# Altium schematic sheet 2018.SchDoc
size A3; SheetNumber: 1; SheetTotal: 1
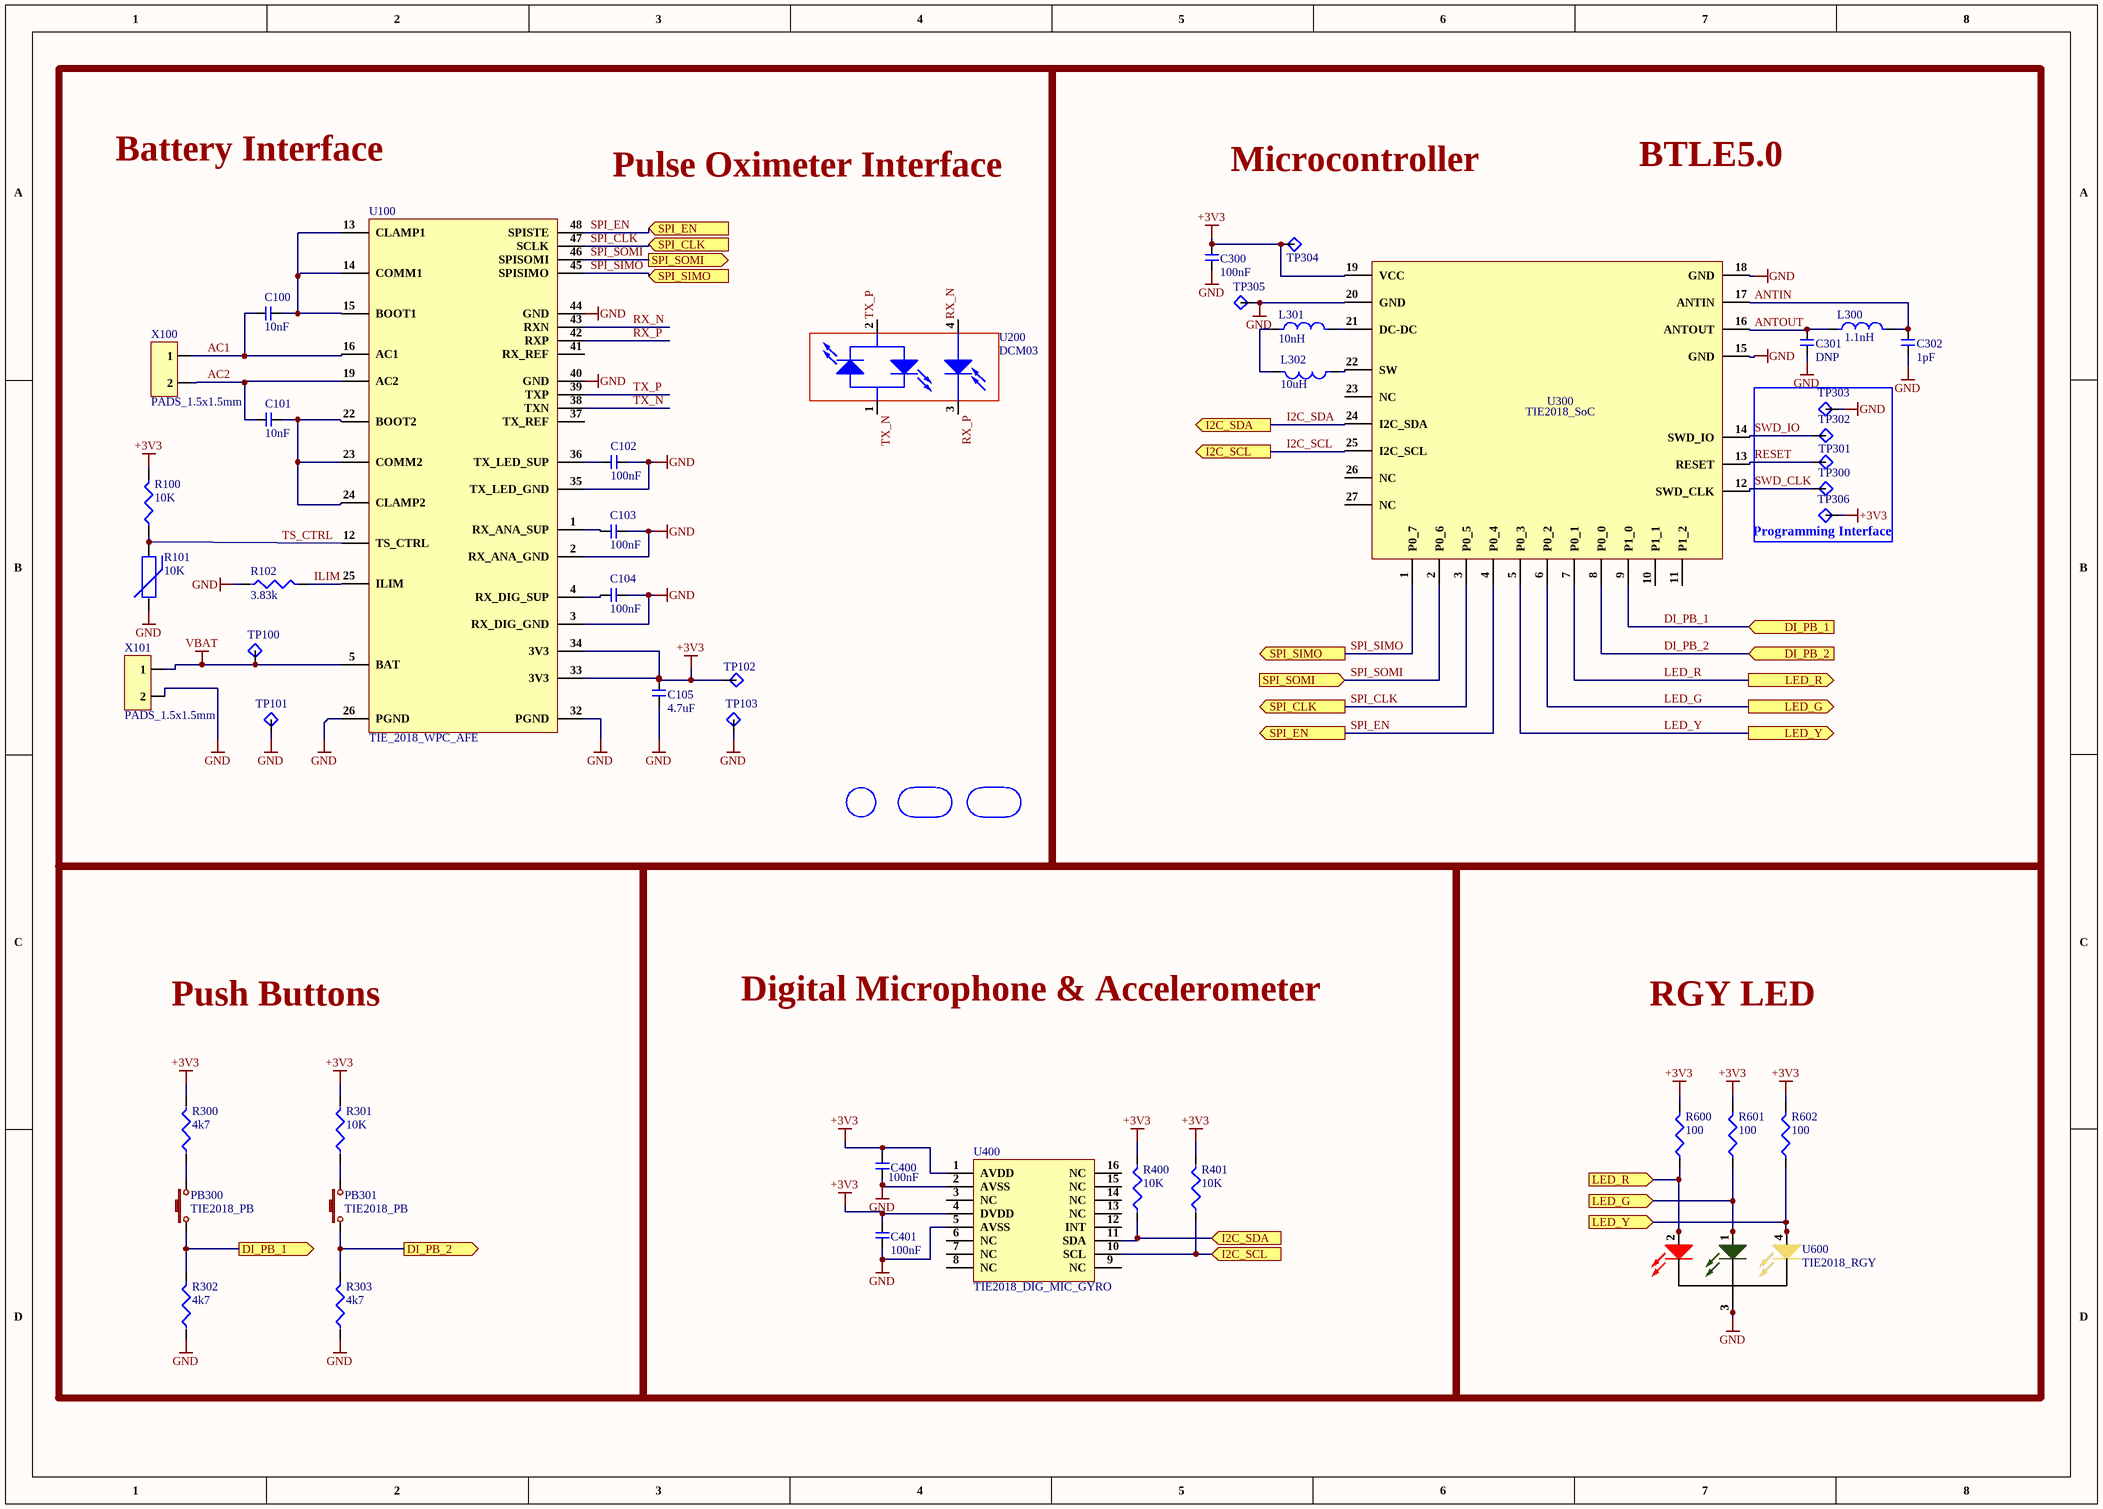
[diagram p0: 2018.SchDoc]

## Parts
C100  10nF  [C0603]
C101  10nF  [C0603]
C102  100nF  [C0402]
C103  100nF  [C0402]
C104  100nF  [C0402]
C105  4.7uF  [C0603]
C300  100nF  [C0402]
C301  DNP  [C0402]
C302  1pF  [C0402]
C400  100nF  [C0402]
C401  100nF  [C0402]
L300  1.1nH  [L0402]
L301  10nH  [L0402]
L302  10uH  [L0603]
MTH100  MTH_2mmx2mm  [MTH_2mmx2mm]  (value not drawn)
MTH101  MTH_2mmx3.5mm  [MTH_2mmx3.5mm]  (value not drawn)
MTH102  MTH_2mmx3.5mm  [MTH_2mmx3.5mm]  (value not drawn)
PB300  TIE2018_PB  [PB]
PB301  TIE2018_PB  [PB]
R100  10K  [R0402]
R101  10K  [R0402]
R102  3.83k  [R0402]
R300  4k7  [R0402]
R301  10K  [R0402]
R302  4k7  [R0402]
R303  4k7  [R0402]
R400  10K  [R0402]
R401  10K  [R0402]
R600  100  [R0402]
R601  100  [R0402]
R602  100  [R0402]
TP100  Test_Point_3  [TestPoint]  (value not drawn)
TP101  Test_Point_3  [TestPoint]  (value not drawn)
TP102  Test_Point_3  [TestPoint]  (value not drawn)
TP103  Test_Point_3  [TestPoint]  (value not drawn)
TP300  Test_Point_3  [TestPoint]  (value not drawn)
TP301  Test_Point_3  [TestPoint]  (value not drawn)
TP302  Test_Point_3  [TestPoint]  (value not drawn)
TP303  Test_Point_3  [TestPoint]  (value not drawn)
TP304  Test_Point_3  [TestPoint]  (value not drawn)
TP305  Test_Point_3  [TestPoint]  (value not drawn)
TP306  Test_Point_3  [TestPoint]  (value not drawn)
U100  TIE_2018_WPC_AFE  [WPC_AFE]
U200  DCM03  [DMC03]
U300  TIE2018_SoC  [SoC]
U400  TIE2018_DIG_MIC_GYRO  [DIGI_MIC_GYRO]
U600  TIE2018_RGY  [SMP4-RGY]
X100  PADS_1.5x1.5mm  [PADS_1.5x1.5mm]
X101  PADS_1.5x1.5mm  [PADS_1.5x1.5mm]

## Blocks framed on the sheet
Programming Interface: TP300-TP303 TP306
Push Buttons: PB300 PB301 R300-R303
Digital Microphone & Accelerometer: C400 C401 R400 R401 U400
RGY LED: R600-R602 U600

## Ports
DI_PB_1 (in), DI_PB_1 (out), DI_PB_2 (in), DI_PB_2 (out), I2C_SCL (in), I2C_SCL (out), I2C_SDA (in), I2C_SDA (out), LED_G (in), LED_G (out), LED_R (in), LED_R (out), LED_Y (in), LED_Y (out), SPI_CLK (in), SPI_CLK (out), SPI_EN (in), SPI_EN (out), SPI_SIMO (in), SPI_SIMO (out), SPI_SOMI (in), SPI_SOMI (out)

## Nets
+3V3: C105.2 C300.2 C400.2 C401.2 R100.2 R300.2 R301.2 R400.2 R401.2 R600.2 R601.2 R602.2 TP102.1 TP304.1 TP306.1 U100.33(3V3) U100.34(3V3) U300.19(VCC) U400.1(AVDD) U400.4(DVDD)
GND: C102.2 C103.2 C104.2 C105.1 C300.1 C301.1 C302.1 C400.1 C401.1 R101.1 R102.1 R302.1 R303.1 TP101.1 TP103.1 TP303.1 TP305.1 U100.2(RX_ANA_GND) U100.3(RX_DIG_GND) U100.26(PGND) U100.32(PGND) U100.35(TX_LED_GND) U100.40(GND) U100.44(GND) U300.15(GND) U300.18(GND) U300.20(GND) U400.2(AVSS) U400.5(AVSS) U600.3 X101.2
VBAT: TP100.1 U100.5(BAT) X101.1
AC1: C100.1 U100.16(AC1) X100.1
AC2: C101.1 U100.19(AC2) X100.2
ANTIN: C302.2 L300.2 U300.17(ANTIN)
ANTOUT: C301.2 L300.1 U300.16(ANTOUT)
DI_PB_1: PB300.1 R302.2 U300.9(P1_0) ; port DI_PB_1
DI_PB_2: PB301.1 R303.2 U300.8(P0_0) ; port DI_PB_2
I2C_SCL: R401.1 U300.25(I2C_SCL) U400.10(SCL) ; port I2C_SCL
I2C_SDA: R400.1 U300.24(I2C_SDA) U400.11(SDA) ; port I2C_SDA
ILIM: R102.2 U100.25(ILIM)
LED_G: R601.1 U300.6(P0_2) U600.1 ; port LED_G
LED_R: R600.1 U300.7(P0_1) U600.2 ; port LED_R
LED_Y: R602.1 U300.5(P0_3) U600.4 ; port LED_Y
RESET: TP301.1 U300.13(RESET)
RX_N: U100.43(RXN) U200.4
RX_P: U100.42(RXP) U200.3
SPI_CLK: U100.47(SCLK) U300.3(P0_5) ; port SPI_CLK
SPI_EN: U100.48(SPISTE) U300.4(P0_4) ; port SPI_EN
SPI_SIMO: U100.45(SPISIMO) U300.1(P0_7) ; port SPI_SIMO
SPI_SOMI: U100.46(SPISOMI) U300.2(P0_6) ; port SPI_SOMI
SWD_CLK: TP300.1 U300.12(SWD_CLK)
SWD_IO: TP302.1 U300.14(SWD_IO)
TS_CTRL: R100.1 R101.2 U100.12(TS_CTRL)
TX_N: U100.38(TXN) U200.1
TX_P: U100.39(TXP) U200.2
NetC100_2: C100.2 U100.13(CLAMP1) U100.14(COMM1) U100.15(BOOT1)
NetC101_2: C101.2 U100.22(BOOT2) U100.23(COMM2) U100.24(CLAMP2)
NetC102_1: C102.1 U100.36(TX_LED_SUP)
NetC103_1: C103.1 U100.1(RX_ANA_SUP)
NetC104_1: C104.1 U100.4(RX_DIG_SUP)
NetL301_1: L301.1 L302.1
NetL301_2: L301.2 U300.21(DC-DC)
NetL302_2: L302.2 U300.22(SW)
NetPB300_2: PB300.2 R300.1
NetPB301_2: PB301.2 R301.1

Not connected (* = marked no-connect by the designer): U100 37(TX_REF) 41(RX_REF); U300 10(P1_1) 11(P1_2) 23(NC) 26(NC) 27(NC); U400 3(NC) 6(NC) 7(NC) 8(NC) 9(NC) 12(INT) 13(NC) 14(NC) 15(NC) 16(NC)

## Notes on the sheet
- Battery Interface
- Pulse Oximeter Interface
- Microcontroller
- BTLE5.0

## Library data of the parts
C100 C101 = C0603X103F3GACTU: Cap, 0.01ΜF, 25V, 1%, C0G/NP0, 0603; Manufacturer: KEMET; Supplier 1: Newark; Supplier Part Number 1: 69AC2632; Manufacturer Part Number: C0603X103F3GACTU; RoHS: Yes; Category: Capacitors; Stock 1: 210; Pricing 1: 1=2.42000, 10=1.96000, 25=1.81000, 50=1.65000, 100=1.50000 (USD); RoHS Compliant: Yes
C102-C104 C300 C400 C401 = 939113424610-T3N: Silicon Capacitor 100nF 11VDC 0402; Manufacturer: Murata; Supplier 1: Avnet; Supplier Part Number 1: 939113424610-T3N; Manufacturer Part Number: 939113424610-T3N; RoHS: No; Category: Capacitors; Pricing 1: 1000=6.60300, 2000=6.41700, 4000=6.23100, 6000=6.04500, 8000=5.85900 (USD)
C105 = C1608X5R1V475M080AC: C Series 0603 4.7 uF 35 V ±20 % Tolerance X5R SMT Multilayer Ceramic Capacitor; Manufacturer: TDK; Voltage Rating: 35V; Tolerance: 20%; Supplier 1: Arrow Electronics; Supplier Part Number 1: C1608X5R1V475M080AC; Manufacturer Part Number: C1608X5R1V475M080AC; RoHS: Yes; Category: Ceramic Capacitors; Stock 1: 2450; Pricing 1: 1=0.42890, 10=0.23670, 25=0.23340, 50=0.22950, 100=0.18270, 250=0.18070, 500=0.13610, 1000=0.11450, 3000=0.11340 (USD); Mount: Surface Mount; Case/Package: 0603; Case Code (Metric): 1608; Case Code (Imperial): 0603; Weight: 7.1E-05oz; Dielectric Material: Ceramic; Min Operating Temperature: -55°C; Max Operating Temperature: 85°C; Capacitance: 4.7uF; Packaging: Tape and Reel; Termination: SMD/SMT; Package Quantity: 1; Voltage Rating (DC): 35V; Dielectric: X5R; Resistor Type: Ceramic; Series: C; Length: 1.6mm; Width: 0.031inch; Height: 0.8mm; Thickness: 0.039inch; Depth: 0.8mm; REACH SVHC: No SVHC; Lead Free: Lead Free; RoHS Compliant: Yes; ComponentLink1URL: https://datasheet.ciiva.com/24218/mlcc-commercial-general-en-24218312.pdf?src-supplier=Mouser; ComponentLink1Description: https://datasheet.ciiva.com/24218/mlcc-commercial-general-en-24218312.pdf?src-supplier=Mouser
C301 = 0402ZC101MAT2A: Cap Ceramic 100pF 10V X7R 20% SMD 0402 125°C Paper T/R; Manufacturer: Kyocera AVX; Supplier 1: Avnet; Supplier Part Number 1: 0402ZC101MAT2A; Manufacturer Part Number: 0402ZC101MAT2A; RoHS: Yes; Category: Ceramic Capacitors; Stock 1: 320000; Pricing 1: 10000=0.04060, 20000=0.04200, 40000=0.03864, 60000=0.03766, 80000=0.03668, 100000=0.03570, 1000000=0.03472 (USD); Mount: Surface Mount; Case/Package: 0402; Number of Pins: 2; Case Code (Imperial): 0402; Case Code (Metric): 1005; Min Operating Temperature: -55°C; Max Operating Temperature: 125°C; Capacitance: 100pF; Package Quantity: 10000; Voltage Rating: 10V; Voltage Rating (DC): 10V; Tolerance: 20%; Packaging: Tape and Reel; Dielectric: X7R; Termination: SMD/SMT; Construction: Flat; Length: 1mm; Width: 0.5mm; Thickness: 0.022inch; Depth: 0.5mm; RoHS Compliant: Yes; ComponentLink1URL: https://datasheet.ciiva.com/5419/cx7r-218113-5419800.pdf?src-supplier=Mouser; ComponentLink1Description: https://datasheet.ciiva.com/5419/cx7r-218113-5419800.pdf?src-supplier=Mouser; ComponentLink2URL: https://datasheet.ciiva.com/206/cx7r-206063.pdf?src-supplier=Digi-Key; ComponentLink2Description: https://datasheet.ciiva.com/206/cx7r-206063.pdf?src-supplier=Digi-Key
C302 = GCM1555C1H1R0CA16J: Cap Ceramic 1pF 50V C0G 0.25pF Pad SMD 0402 125C Automotive T/R; Manufacturer: Murata; Supplier 1: Arrow Electronics; Supplier Part Number 1: GCM1555C1H1R0CA16J; Manufacturer Part Number: GCM1555C1H1R0CA16J; RoHS: Yes; Category: Ceramic Capacitors; Stock 1: 268213; Pricing 1: 1=0.06050, 10=0.03030, 25=0.03000, 100=0.01940, 250=0.01910, 500=0.01350, 1000=0.01080, 3000=0.00950, 6000=0.00890, 15000=0.00840, 30000=0.00830, 75000=0.00820, 150000=0.00810 (USD); Mount: Surface Mount; Case/Package: 0402; Case Code (Imperial): 0402; Case Code (Metric): 1005; Weight: 0.000212oz; Min Operating Temperature: -55°C; Max Operating Temperature: 125°C; Capacitance: 1pF; Packaging: Tape and Reel; Voltage Rating: 50V; Dielectric: C0G; Termination: SMD/SMT; Voltage Rating (DC): 50V; Package Quantity: 50000; Length: 0.039inch; Width: 0.02inch; Height: 0.5mm; Thickness: 0.022inch; Ratings: AEC-Q200; ComponentLink1URL: http://www.mouser.com/ds/2/281/c03e-806517.pdf?src-supplier=Mouser; ComponentLink1Description: http://www.mouser.com/ds/2/281/c03e-806517.pdf?src-supplier=Mouser; ComponentLink2URL: https://search.murata.co.jp/Ceramy/image/img/A01X/G101/ENG/GCM1555C1H1R0CA16-01.pdf?src-supplier=Digi-Key; ComponentLink2Description: https://search.murata.co.jp/Ceramy/image/img/A01X/G101/ENG/GCM1555C1H1R0CA16-01.pdf?src-supplier=Digi-Key; ComponentLink3URL: http://www.murata.com/~/media/webrenewal/support/library/catalog/products/capacitor/mlcc/c03e.ashx?src-supplier=Digi-Key; ComponentLink3Description: http://www.murata.com/~/media/webrenewal/support/library/catalog/products/capacitor/mlcc/c03e.ashx?src-supplier=Digi-Key
L300 = LQG15WZ1N1C02D: Inductor RF Chip Unshielded Multi-Layer 0.0011uH 0.2nH 100MHz Air 1.2A 0.03Ohm DCR 0402 Automotive T/R; Manufacturer: Murata; DC Resistance (DCR): 30mR; Self Resonant Frequency: 14GHz; Supplier 1: Arrow Electronics; Supplier Part Number 1: LQG15WZ1N1C02D; Manufacturer Part Number: LQG15WZ1N1C02D; RoHS: Yes; Category: Fixed Inductors; Stock 1: 6887; Pricing 1: 1=0.04140, 10=0.04070, 25=0.04000, 100=0.03950, 250=0.03880, 500=0.03830, 1000=0.03760, 3000=0.03700, 6000=0.03640 (USD); Mount: Surface Mount; Case/Package: 0402; Core Material: Air; Case Code (Imperial): 0402; Case Code (Metric): 1005; Min Operating Temperature: -55°C; Max Operating Temperature: 125°C; Packaging: Tape and Reel; Inductance: 1.1nH; Current Rating: 1.2A; Shielding: Unshielded; Test Frequency: 100MHz; Ratings: AEC-Q200; RoHS Compliant: Yes; ComponentLink1URL: http://search.murata.co.jp/Ceramy/image/img/P02/JELF243B-9117.pdf?src-supplier=Digi-Key; ComponentLink1Description: http://search.murata.co.jp/Ceramy/image/img/P02/JELF243B-9117.pdf?src-supplier=Digi-Key; ComponentLink2URL: https://search.murata.co.jp/Ceramy/image/img/P02/JELF243B-9117.pdf?src-supplier=Digi-Key; ComponentLink2Description: https://search.murata.co.jp/Ceramy/image/img/P02/JELF243B-9117.pdf?src-supplier=Digi-Key
L301 = MHQ1005P10NJT000: Inductor High Frequency Chip Unshielded Multi-Layer 0.01uH 5% 100MHz 23Q-Factor Ceramic 0.5A 0.19Ohm DCR 0402 T/R; Manufacturer: TDK; Core Material: Non-Magnetic; Current Rating: 500mA; DC Resistance (DCR): 190mR; Self Resonant Frequency: 3.3GHz; Supplier 1: Arrow Electronics; Supplier Part Number 1: MHQ1005P10NJT000; Manufacturer Part Number: MHQ1005P10NJT000; RoHS: Yes; Category: Fixed Inductors; Stock 1: 9027; Pricing 1: 1=0.17480, 10=0.12050, 25=0.11830, 100=0.09750, 250=0.09360, 500=0.08470, 1000=0.07090, 3000=0.05930, 6000=0.05690 (USD); Mount: Surface Mount; Case/Package: 0402; Case Code (Metric): 1005; Case Code (Imperial): 0402; Min Operating Temperature: -55°C; Max Operating Temperature: 125°C; Package Quantity: 10000; Packaging: Tape and Reel; Tolerance: 5%; Shielding: Unshielded; Inductance Tolerance: 5%; Inductance: 10nH; Test Frequency: 100MHz; Max DC Current: 500mA; Length: 0.039inch; Width: 0.02inch; Height - Seated (Max): 0.024inch; RoHS Compliant: Yes; ComponentLink1URL: https://datasheet.ciiva.com/29683/inductor-commercial-high-frequency-mhq-en-29683658.pdf?src-supplier=Digi-Key; ComponentLink1Description: https://datasheet.ciiva.com/29683/inductor-commercial-high-frequency-mhq-en-29683658.pdf?src-supplier=Digi-Key; ComponentLink2URL: https://datasheet.ciiva.com/29683/inductor-commercial-high-frequency-mhq-en-29683659.pdf?src-supplier=Digi-Key; ComponentLink2Description: https://datasheet.ciiva.com/29683/inductor-commercial-high-frequency-mhq-en-29683659.pdf?src-supplier=Digi-Key; ComponentLink3URL: https://datasheet.ciiva.com/29683/inductor-commercial-high-frequency-mhq-en-29683660.pdf?src-supplier=Digi-Key; ComponentLink3Description: https://datasheet.ciiva.com/29683/inductor-commercial-high-frequency-mhq-en-29683660.pdf?src-supplier=Digi-Key
L302 = LQM18FN100M00D: 0603 10uH ±20% DCR=0.9Ω 50mA SRF=30MHz; Manufacturer: Murata; Core Material: Ferrite; Self Resonant Frequency: 30MHz; Shielding: Shielded; DC Resistance (DCR): 1.17R; Test Frequency: 1MHz; Supplier 1: Arrow Electronics; Supplier Part Number 1: LQM18FN100M00D; Manufacturer Part Number: LQM18FN100M00D; RoHS: Yes; Category: Fixed Inductors; Stock 1: 3450; Pricing 1: 1=0.15720, 10=0.10770, 25=0.09610, 100=0.08640, 250=0.08260, 500=0.08180, 1000=0.07310, 3000=0.07220 (USD); Mount: Surface Mount; Case/Package: 0603; Case Code (Metric): 1608; Case Code (Imperial): 0603; Min Operating Temperature: -55°C; Max Operating Temperature: 125°C; Packaging: Tape and Reel; Package Quantity: 4000; Tolerance: 20%; Current Rating: 50mA; Inductance: 10uH; Saturation Current: 50mA; Max DC Current: 50mA; Termination: SMD/SMT; DC Current: 50mA; Series: LQM18F; Length: 0.063inch; Width: 0.031inch; Height: 0.9mm; Height - Seated (Max): 0.035inch; Depth: 0.9mm; Radiation Hardening: No; Military Standard: Not; Lead Free: Lead Free; RoHS Compliant: Yes; ComponentLink1URL: https://datasheet.ciiva.com/11799/0900766b80f15512-11799471.pdf?src-supplier=RSComponents; ComponentLink1Description: https://datasheet.ciiva.com/11799/0900766b80f15512-11799471.pdf?src-supplier=RSComponents; ComponentLink2URL: https://datasheet.ciiva.com/3865/286lqm18fn100m0023-3865365.pdf?src-supplier=Arrow+Electronics; ComponentLink2Description: https://datasheet.ciiva.com/3865/286lqm18fn100m0023-3865365.pdf?src-supplier=Arrow+Electronics; ComponentLink3URL: https://datasheet.ciiva.com/1039/l0075s0097lqm18f-1039418.pdf?src-supplier=Digi-Key; ComponentLink3Description: https://datasheet.ciiva.com/1039/l0075s0097lqm18f-1039418.pdf?src-supplier=Digi-Key; ComponentLink4URL: https://datasheet.ciiva.com/1039/l0075s0097lqm18f-1039417.pdf?src-supplier=Digi-Key; ComponentLink4Description: https://datasheet.ciiva.com/1039/l0075s0097lqm18f-1039417.pdf?src-supplier=Digi-Key; ComponentLink5URL: https://datasheet.ciiva.com/1039/l0075s0097lqm18f-1039419.pdf?src-supplier=Digi-Key; ComponentLink5Description: https://datasheet.ciiva.com/1039/l0075s0097lqm18f-1039419.pdf?src-supplier=Digi-Key; ComponentLink6URL: https://datasheet.ciiva.com/8510/l0075s0097lqm18f-8510087.pdf?src-supplier=Avnet; ComponentLink6Description: https://datasheet.ciiva.com/8510/l0075s0097lqm18f-8510087.pdf?src-supplier=Avnet; ComponentLink7URL: https://datasheet.ciiva.com/8510/l0075s0097lqm18f-8510328.pdf?src-supplier=Avnet; ComponentLink7Description: https://datasheet.ciiva.com/8510/l0075s0097lqm18f-8510328.pdf?src-supplier=Avnet
PB300 PB301 = Push_Button
R100 R301 R400 R401 = CR0402-FX-1002GLF: Res Thick Film 0402 10K Ohm 1% 1/16W ±100ppm/°C Molded SMD SMD Paper Tape on Plastic Reel; Manufacturer: Bourns; Resistance: 10kR; Power Rating: 62.5mW; Voltage Rating: 50V; Max Power Dissipation: 63mW; Supplier 1: Arrow Electronics; Supplier Part Number 1: CR0402-FX-1002GLF; Manufacturer Part Number: CR0402-FX-1002GLF; RoHS: Yes; Category: Chip SMD Resistors; Stock 1: 1909; Pricing 1: 1=0.04140, 10=0.01700, 25=0.00880, 100=0.00430, 250=0.00410, 500=0.00360 (USD); Mount: Surface Mount; Case/Package: 0402; Case Code (Metric): 1005; Case Code (Imperial): 0402; Contact Plating: Tin; Min Operating Temperature: -55°C; Max Operating Temperature: 125°C; Packaging: Tape and Reel; Tolerance: 1%; Package Quantity: 10000; Resistor Type: Thick Film; Number of Terminations: 2; Termination: SMD/SMT; Temperature Coefficient: 100ppm/°C; Voltage Rating (DC): 50V; Series: CR0402; Resistance Tolerance: 1%; Technology: THICK FILM; Construction: Rectangular; Length: 1mm; Width: 0.5mm; Height: 0.35mm; Depth: 0.5mm; Thickness: 356um; Radiation Hardening: No; REACH SVHC: No SVHC; Military Standard: Not; RoHS Compliant: Yes; ComponentLink1URL: https://datasheet.ciiva.com/30490/0900766b812730ae-30490501.pdf?src-supplier=RSComponents; ComponentLink1Description: https://datasheet.ciiva.com/30490/0900766b812730ae-30490501.pdf?src-supplier=RSComponents; ComponentLink2URL: https://datasheet.ciiva.com/22713/659744-22713205.pdf?src-supplier=Element14; ComponentLink2Description: https://datasheet.ciiva.com/22713/659744-22713205.pdf?src-supplier=Element14; ComponentLink3URL: https://datasheet.ciiva.com/22644/659744-22644166.pdf?src-supplier=Element14; ComponentLink3Description: https://datasheet.ciiva.com/22644/659744-22644166.pdf?src-supplier=Element14; ComponentLink4URL: https://datasheet.ciiva.com/6562/cr0402-6562871.pdf?src-supplier=Digi-Key; ComponentLink4Description: https://datasheet.ciiva.com/6562/cr0402-6562871.pdf?src-supplier=Digi-Key; ComponentLink5URL: https://datasheet.ciiva.com/6562/cr0402-6562873.pdf?src-supplier=Digi-Key; ComponentLink5Description: https://datasheet.ciiva.com/6562/cr0402-6562873.pdf?src-supplier=Digi-Key; ComponentLink6URL: https://datasheet.ciiva.com/7606/1896412-7606203.pdf?src-supplier=Newark; ComponentLink6Description: https://datasheet.ciiva.com/7606/1896412-7606203.pdf?src-supplier=Newark; ComponentLink7URL: https://datasheet.ciiva.com/3255/cr0402-3255916.pdf?src-supplier=Avnet; ComponentLink7Description: https://datasheet.ciiva.com/3255/cr0402-3255916.pdf?src-supplier=Avnet; ComponentLink8URL: https://datasheet.ciiva.com/30133/cr0402-30133006.pdf?src-supplier=Onlinecomponents.com; ComponentLink8Description: https://datasheet.ciiva.com/30133/cr0402-30133006.pdf?src-supplier=Onlinecomponents.com; ComponentLink9URL: https://datasheet.ciiva.com/6562/cr0402-6562911.pdf?src-supplier=Digi-Key; ComponentLink9Description: https://datasheet.ciiva.com/6562/cr0402-6562911.pdf?src-supplier=Digi-Key
R101 = CQ02WGJ0103TCE: Manufacturer: Royal Electronic Factory; Supplier 1: Mouser; Supplier Part Number 1: 303-CQ02WGJ0103TCE; Manufacturer Part Number: CQ02WGJ0103TCE; RoHS: No; Pricing 1: 10000=0.00400 (USD)
R102 = CR0402-FX-3831GLF: Res Thick Film 0402 3.83K Ohm 1% 1/16W 100ppm/C Molded SMD SMD Paper Tape on Plastic Reel; Manufacturer: Bourns; Resistance: 3.83kR; Temperature Coefficient: 100ppm/°C; Max Power Dissipation: 63mW; Supplier 1: Arrow Electronics; Supplier Part Number 1: CR0402-FX-3831GLF; Manufacturer Part Number: CR0402-FX-3831GLF; RoHS: Yes; Category: Chip SMD Resistors; Stock 1: 18825; Pricing 1: 1=0.03640, 10=0.00620, 25=0.00610, 100=0.00250, 250=0.00230, 1000=0.00140, 6000=0.00130 (USD); Mount: Surface Mount; Case/Package: 0402; Min Operating Temperature: -55°C; Max Operating Temperature: 125°C; Packaging: Tape and Reel; Tolerance: 1%; Package Quantity: 10000; Resistor Type: Thick Film; Number of Terminations: 2; Series: CR0402; Construction: Rectangular; Length: 0.039inch; Width: 0.02inch; Height: 0.016inch; Depth: 0.5mm; Thickness: 356um; Military Standard: Not; RoHS Compliant: Yes; ComponentLink1URL: https://datasheet.ciiva.com/29522/cr0402-29522207.pdf?src-supplier=Digi-Key; ComponentLink1Description: https://datasheet.ciiva.com/29522/cr0402-29522207.pdf?src-supplier=Digi-Key
R300 R302 R303 = TNPU04024K70BZEP00: TNPU0402 4K7 0.1% T-16 EP1 E3; Manufacturer: Vishay Dale; Supplier 1: Digi-Key; Supplier Part Number 1: 541-TNPU04024K70BZEP00CT-ND; Manufacturer Part Number: TNPU04024K70BZEP00; RoHS: No; Category: Chip SMD Resistors; Stock 1: 529; Pricing 1: 1=1.77000, 10=1.56800, 100=1.19710 (USD)
R600-R602 = CR0402-FX-1000GLF: Res Thick Film 0402 100 Ohm 1% 1/16W ±100ppm/°C Molded SMD SMD Paper Tape on Plastic Reel; Manufacturer: Bourns; Resistance: 100R; Power Rating: 62.5mW; Voltage Rating: 50V; Max Power Dissipation: 63mW; Supplier 1: Arrow Electronics; Supplier Part Number 1: CR0402-FX-1000GLF; Manufacturer Part Number: CR0402-FX-1000GLF; RoHS: Yes; Category: Chip SMD Resistors; Stock 1: 33734; Pricing 1: 1=0.05320, 10=0.01080, 25=0.00900, 100=0.00890, 250=0.00730, 500=0.00620, 1000=0.00610, 3000=0.00600, 6000=0.00360, 15000=0.00190, 30000=0.00140 (USD); Mount: Surface Mount; Case/Package: 0402; Case Code (Metric): 1005; Case Code (Imperial): 0402; Contact Plating: Tin; Min Operating Temperature: -55°C; Max Operating Temperature: 125°C; Tolerance: 1%; Packaging: Tape and Reel; Package Quantity: 1; Resistor Type: Thick Film; Number of Terminations: 2; Termination: SMD/SMT; Temperature Coefficient: 100ppm/°C; Voltage Rating (DC): 50V; Series: CR0402; Resistance Tolerance: 1%; Technology: THICK FILM; Length: 1mm; Width: 0.5mm; Height: 0.35mm; Depth: 0.5mm; Thickness: 356um; Radiation Hardening: No; REACH SVHC: No SVHC; RoHS Compliant: Yes; ComponentLink1URL: https://datasheet.ciiva.com/30490/0900766b812730ae-30490502.pdf?src-supplier=RSComponents; ComponentLink1Description: https://datasheet.ciiva.com/30490/0900766b812730ae-30490502.pdf?src-supplier=RSComponents; ComponentLink2URL: https://datasheet.ciiva.com/7606/1896412-7606202.pdf?src-supplier=Newark; ComponentLink2Description: https://datasheet.ciiva.com/7606/1896412-7606202.pdf?src-supplier=Newark; ComponentLink3URL: https://datasheet.ciiva.com/9120/cr0402-9120731.pdf?src-supplier=Avnet; ComponentLink3Description: https://datasheet.ciiva.com/9120/cr0402-9120731.pdf?src-supplier=Avnet; ComponentLink4URL: https://datasheet.ciiva.com/9116/cr0402-9116748.pdf?src-supplier=Avnet; ComponentLink4Description: https://datasheet.ciiva.com/9116/cr0402-9116748.pdf?src-supplier=Avnet; ComponentLink5URL: https://datasheet.ciiva.com/6548/cr0402-6548045.pdf?src-supplier=Digi-Key; ComponentLink5Description: https://datasheet.ciiva.com/6548/cr0402-6548045.pdf?src-supplier=Digi-Key; ComponentLink6URL: https://datasheet.ciiva.com/6548/cr0402-6548047.pdf?src-supplier=Digi-Key; ComponentLink6Description: https://datasheet.ciiva.com/6548/cr0402-6548047.pdf?src-supplier=Digi-Key
U100 = WPC_AFE
U300 = SoC
U400 = DIG_MIC_GYRO
U600 = SMP4-RGY: LED SMD PLCC4 Tri-Color Red/Green/Yellow Clr Lens 120Deg View Angle; Manufacturer: Bivar; Lens Color: Colorless; Forward Voltage: 1.9V; Illumination Color: Green,Red,Yellow; Forward Current: 20mA; Luminous Intensity: 16mcd; Dominant Wavelength: 585nm; Lens Style: Clear,Round; Viewing Angle: 120°; Power Rating: 72mW; Lens Transparency: Clear; Supplier 1: Newark; Supplier Part Number 1: 73R3964; Manufacturer Part Number: SMP4-RGY; RoHS: Yes; Category: LEDs; Mount: Surface Mount; Case/Package: PLCC; Number of Pins: 4; Color: Green,Red,Yellow; Min Operating Temperature: -40°C; Max Operating Temperature: 85°C; Package Quantity: 2000; Packaging: Tape and Reel; Test Current: 20mA; Series: -; Length: 3.2mm; Width: 2.8mm; Height: 1.85mm; RoHS Compliant: Yes; REACH SVHC: Unknown; Lead Free: Lead Free; ComponentLink1URL: https://datasheet.ciiva.com/4689/smp4-rgy-66584-4689315.pdf?src-supplier=Mouser; ComponentLink1Description: https://datasheet.ciiva.com/4689/smp4-rgy-66584-4689315.pdf?src-supplier=Mouser; ComponentLink2URL: https://datasheet.ciiva.com/22655/1825802-22655989.pdf?src-supplier=Element14; ComponentLink2Description: https://datasheet.ciiva.com/22655/1825802-22655989.pdf?src-supplier=Element14; ComponentLink3URL: https://datasheet.ciiva.com/16488/smp4-rgy-16488225.pdf?src-supplier=Future+Electronics; ComponentLink3Description: https://datasheet.ciiva.com/16488/smp4-rgy-16488225.pdf?src-supplier=Future+Electronics; ComponentLink4URL: https://datasheet.ciiva.com/2112/smp4-rgy-2112236.pdf?src-supplier=Digi-Key; ComponentLink4Description: https://datasheet.ciiva.com/2112/smp4-rgy-2112236.pdf?src-supplier=Digi-Key; ComponentLink5URL: https://datasheet.ciiva.com/2112/smp4-rgy-2112238.pdf?src-supplier=Digi-Key; ComponentLink5Description: https://datasheet.ciiva.com/2112/smp4-rgy-2112238.pdf?src-supplier=Digi-Key; ComponentLink6URL: https://datasheet.ciiva.com/48979/70536505-48979515.pdf?src-supplier=Allied+Electronics; ComponentLink6Description: https://datasheet.ciiva.com/48979/70536505-48979515.pdf?src-supplier=Allied+Electronics; ComponentLink7URL: https://datasheet.ciiva.com/2112/smp4-rgy-2112237.pdf?src-supplier=Digi-Key; ComponentLink7Description: https://datasheet.ciiva.com/2112/smp4-rgy-2112237.pdf?src-supplier=Digi-Key